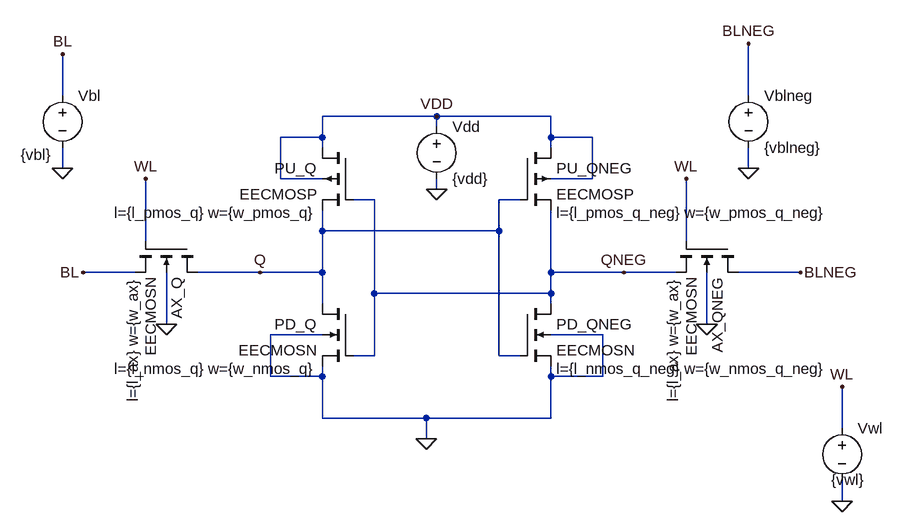
[diagram p0: schematic standard_hold.asc]
standard_hold.asc, the LTspice schematic file:
Version 4
SHEET 1 1636 4668
WIRE -384 -16 -384 -80
WIRE 672 -16 672 -96
WIRE 192 16 16 16
WIRE 368 16 192 16
WIRE 192 32 192 16
WIRE 16 48 16 16
WIRE 16 48 -48 48
WIRE 368 48 368 16
WIRE 432 48 368 48
WIRE 16 64 16 48
WIRE 368 64 368 48
WIRE -384 96 -384 64
WIRE 672 96 672 64
WIRE -48 112 -48 48
WIRE 16 112 -48 112
WIRE 432 112 432 48
WIRE 432 112 368 112
WIRE 192 128 192 112
WIRE 96 144 64 144
WIRE 320 144 288 144
WIRE 16 192 16 160
WIRE 288 192 288 144
WIRE 288 192 16 192
WIRE -256 208 -256 112
WIRE 576 208 576 112
WIRE -272 256 -352 256
WIRE -80 256 -176 256
WIRE 16 256 16 192
WIRE 16 256 -80 256
WIRE 368 256 368 160
WIRE 480 256 368 256
WIRE 560 256 480 256
WIRE 752 256 656 256
WIRE 96 288 96 144
WIRE 368 288 368 256
WIRE 368 288 96 288
WIRE 16 304 16 256
WIRE 368 304 368 288
WIRE -224 336 -224 256
WIRE 608 336 608 256
WIRE 16 352 -64 352
WIRE 448 352 368 352
WIRE 96 384 96 288
WIRE 96 384 64 384
WIRE 288 384 288 192
WIRE 320 384 288 384
WIRE -64 416 -64 352
WIRE 16 416 16 400
WIRE 16 416 -64 416
WIRE 368 416 368 400
WIRE 448 416 448 352
WIRE 448 416 368 416
WIRE 16 480 16 416
WIRE 176 480 16 480
WIRE 368 480 368 416
WIRE 368 480 176 480
WIRE 816 496 816 432
WIRE 176 512 176 480
WIRE 816 608 816 576
FLAG 176 512 0
FLAG -224 336 0
FLAG 608 336 0
FLAG 192 128 0
FLAG -384 96 0
FLAG 816 608 0
FLAG 672 96 0
FLAG -80 256 Q
FLAG 480 256 QNEG
FLAG 576 112 WL
FLAG -256 112 WL
FLAG 752 256 BLNEG
FLAG -352 256 BL
FLAG 816 432 WL
FLAG -384 -80 BL
FLAG 672 -96 BLNEG
FLAG 192 16 VDD
SYMBOL pmos4 320 64 R0
WINDOW 123 56 100 Left 2
SYMATTR Value2 l={l_pmos_q_neg} w={w_pmos_q_neg}
SYMATTR InstName PU_QNEG
SYMATTR Value EECMOSP
SYMBOL pmos4 64 64 M0
WINDOW 123 56 100 Left 2
SYMATTR Value2 l={l_pmos_q} w={w_pmos_q}
SYMATTR InstName PU_Q
SYMATTR Value EECMOSP
SYMBOL nmos4 320 304 R0
WINDOW 123 56 100 Left 2
SYMATTR Value2 l={l_nmos_q_neg} w={w_nmos_q_neg}
SYMATTR InstName PD_QNEG
SYMATTR Value EECMOSN
SYMBOL nmos4 64 304 M0
WINDOW 123 56 100 Left 2
SYMATTR Value2 l={l_nmos_q} w={w_nmos_q}
SYMATTR InstName PD_Q
SYMATTR Value EECMOSN
SYMBOL nmos4 656 208 R90
WINDOW 123 56 100 Left 2
SYMATTR Value2 l={l_ax} w={w_ax}
SYMATTR InstName AX_QNEG
SYMATTR Value EECMOSN
SYMBOL nmos4 -176 208 R90
WINDOW 123 56 100 Left 2
SYMATTR Value2 l={l_ax} w={w_ax}
SYMATTR InstName AX_Q
SYMATTR Value EECMOSN
SYMBOL voltage 192 16 R0
WINDOW 123 0 0 Left 0
WINDOW 39 0 0 Left 0
SYMATTR InstName Vdd
SYMATTR Value {vdd}
SYMBOL voltage -384 -32 R0
WINDOW 3 -17 107 Right 2
WINDOW 123 0 0 Left 0
WINDOW 39 0 0 Left 0
SYMATTR Value {vbl}
SYMATTR InstName Vbl
SYMBOL voltage 672 -32 R0
WINDOW 123 0 0 Left 0
WINDOW 39 0 0 Left 0
SYMATTR InstName Vblneg
SYMATTR Value {vblneg}
SYMBOL voltage 816 480 R0
WINDOW 3 34 95 Right 2
WINDOW 123 0 0 Left 0
WINDOW 39 0 0 Left 0
SYMATTR Value {vwl}
SYMATTR InstName Vwl

The netlist it stands for:
* standard_hold.asc
M§PU_QNEG VDD Q QNEG VDD EECMOSP l={l_pmos_q_neg} w={w_pmos_q_neg}
M§PU_Q VDD QNEG Q VDD EECMOSP l={l_pmos_q} w={w_pmos_q}
M§PD_QNEG QNEG Q 0 0 EECMOSN l={l_nmos_q_neg} w={w_nmos_q_neg}
M§PD_Q Q QNEG 0 0 EECMOSN l={l_nmos_q} w={w_nmos_q}
M§AX_QNEG BLNEG WL QNEG 0 EECMOSN l={l_ax} w={w_ax}
M§AX_Q Q WL BL 0 EECMOSN l={l_ax} w={w_ax}
Vdd VDD 0 {vdd}
Vbl BL 0 {vbl}
Vblneg BLNEG 0 {vblneg}
Vwl WL 0 {vwl}
.model NMOS NMOS
.model PMOS PMOS
.lib standard.mos
.backanno
.end